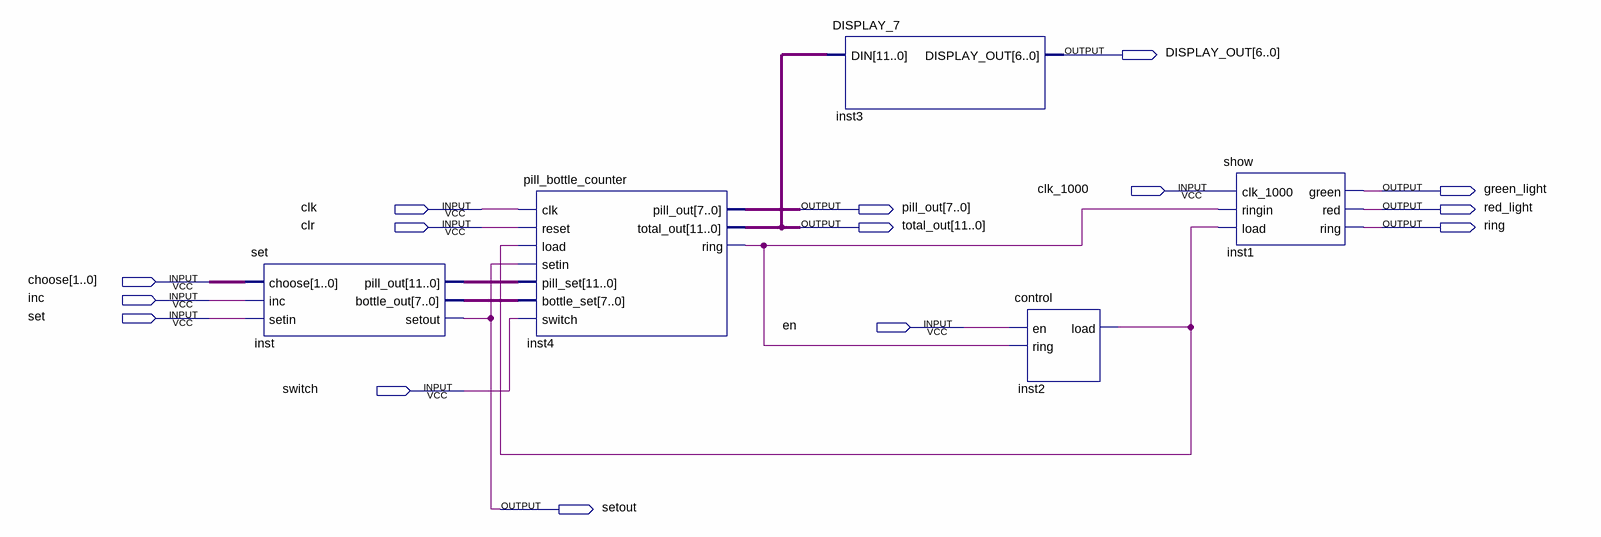
[diagram p0: schematic sheet]
// Quartus schematic DigitalLogic.bdf as structural Verilog: 5 symbols, 15 pins
module DigitalLogic (
  input  clk_1000,
  input  clk,
  input  clr,
  input  [1:0] choose,
  input  inc,
  input  set,
  input  en,
  input  switch,
  output [6:0] DISPLAY_OUT,
  output green_light,
  output [7:0] pill_out,
  output red_light,
  output [11:0] total_out,
  output ring,
  output setout
);

  wire inst2_load, inst4_ring;
  wire [7:0] inst_bottle_out;
  wire [11:0] inst_pill_out;

  set inst (
    .choose(choose), .inc(inc), .setin(set), .pill_out(inst_pill_out), .bottle_out(inst_bottle_out),
    .setout(setout));
  pill_bottle_counter inst4 (
    .clk(clk), .reset(clr), .load(inst2_load), .setin(setout), .pill_set(inst_pill_out),
    .bottle_set(inst_bottle_out), .switch(switch), .pill_out(pill_out), .total_out(total_out),
    .ring(inst4_ring));
  DISPLAY_7 inst3 (.DIN(total_out), .DISPLAY_OUT(DISPLAY_OUT));
  control inst2 (.en(en), .ring(inst4_ring), .load(inst2_load));
  show inst1 (
    .clk_1000(clk_1000), .ringin(inst4_ring), .load(inst2_load), .green(green_light), .red(red_light),
    .ring(ring));
endmodule
